# Altium schematic sheet schema3.SchDoc
size A3; DrawnBy: CdB; Engineer: CdB; Organization: Ultimaker B.V.; DocumentNumber: 3; Revision: 1548-I; SheetNumber: 3; SheetTotal: 6; PageSetup: Record=PageOptions|CenterHorizontal=True|CenterVertical=True|PrintScale=1.01|XCorrection=1.00|YCorrection=1.00|PrintKind=1|BorderSize=5000000|LeftOffset=0|BottomOffset=0|Orientation=2|PaperLength=1000|PaperWidth=1000|Scale=100|PaperSource=7|PrintQuality=600|MediaType=1|DitherType=10|PaperKind=A3 (297 x 420mm)|PrintScaleMode=1
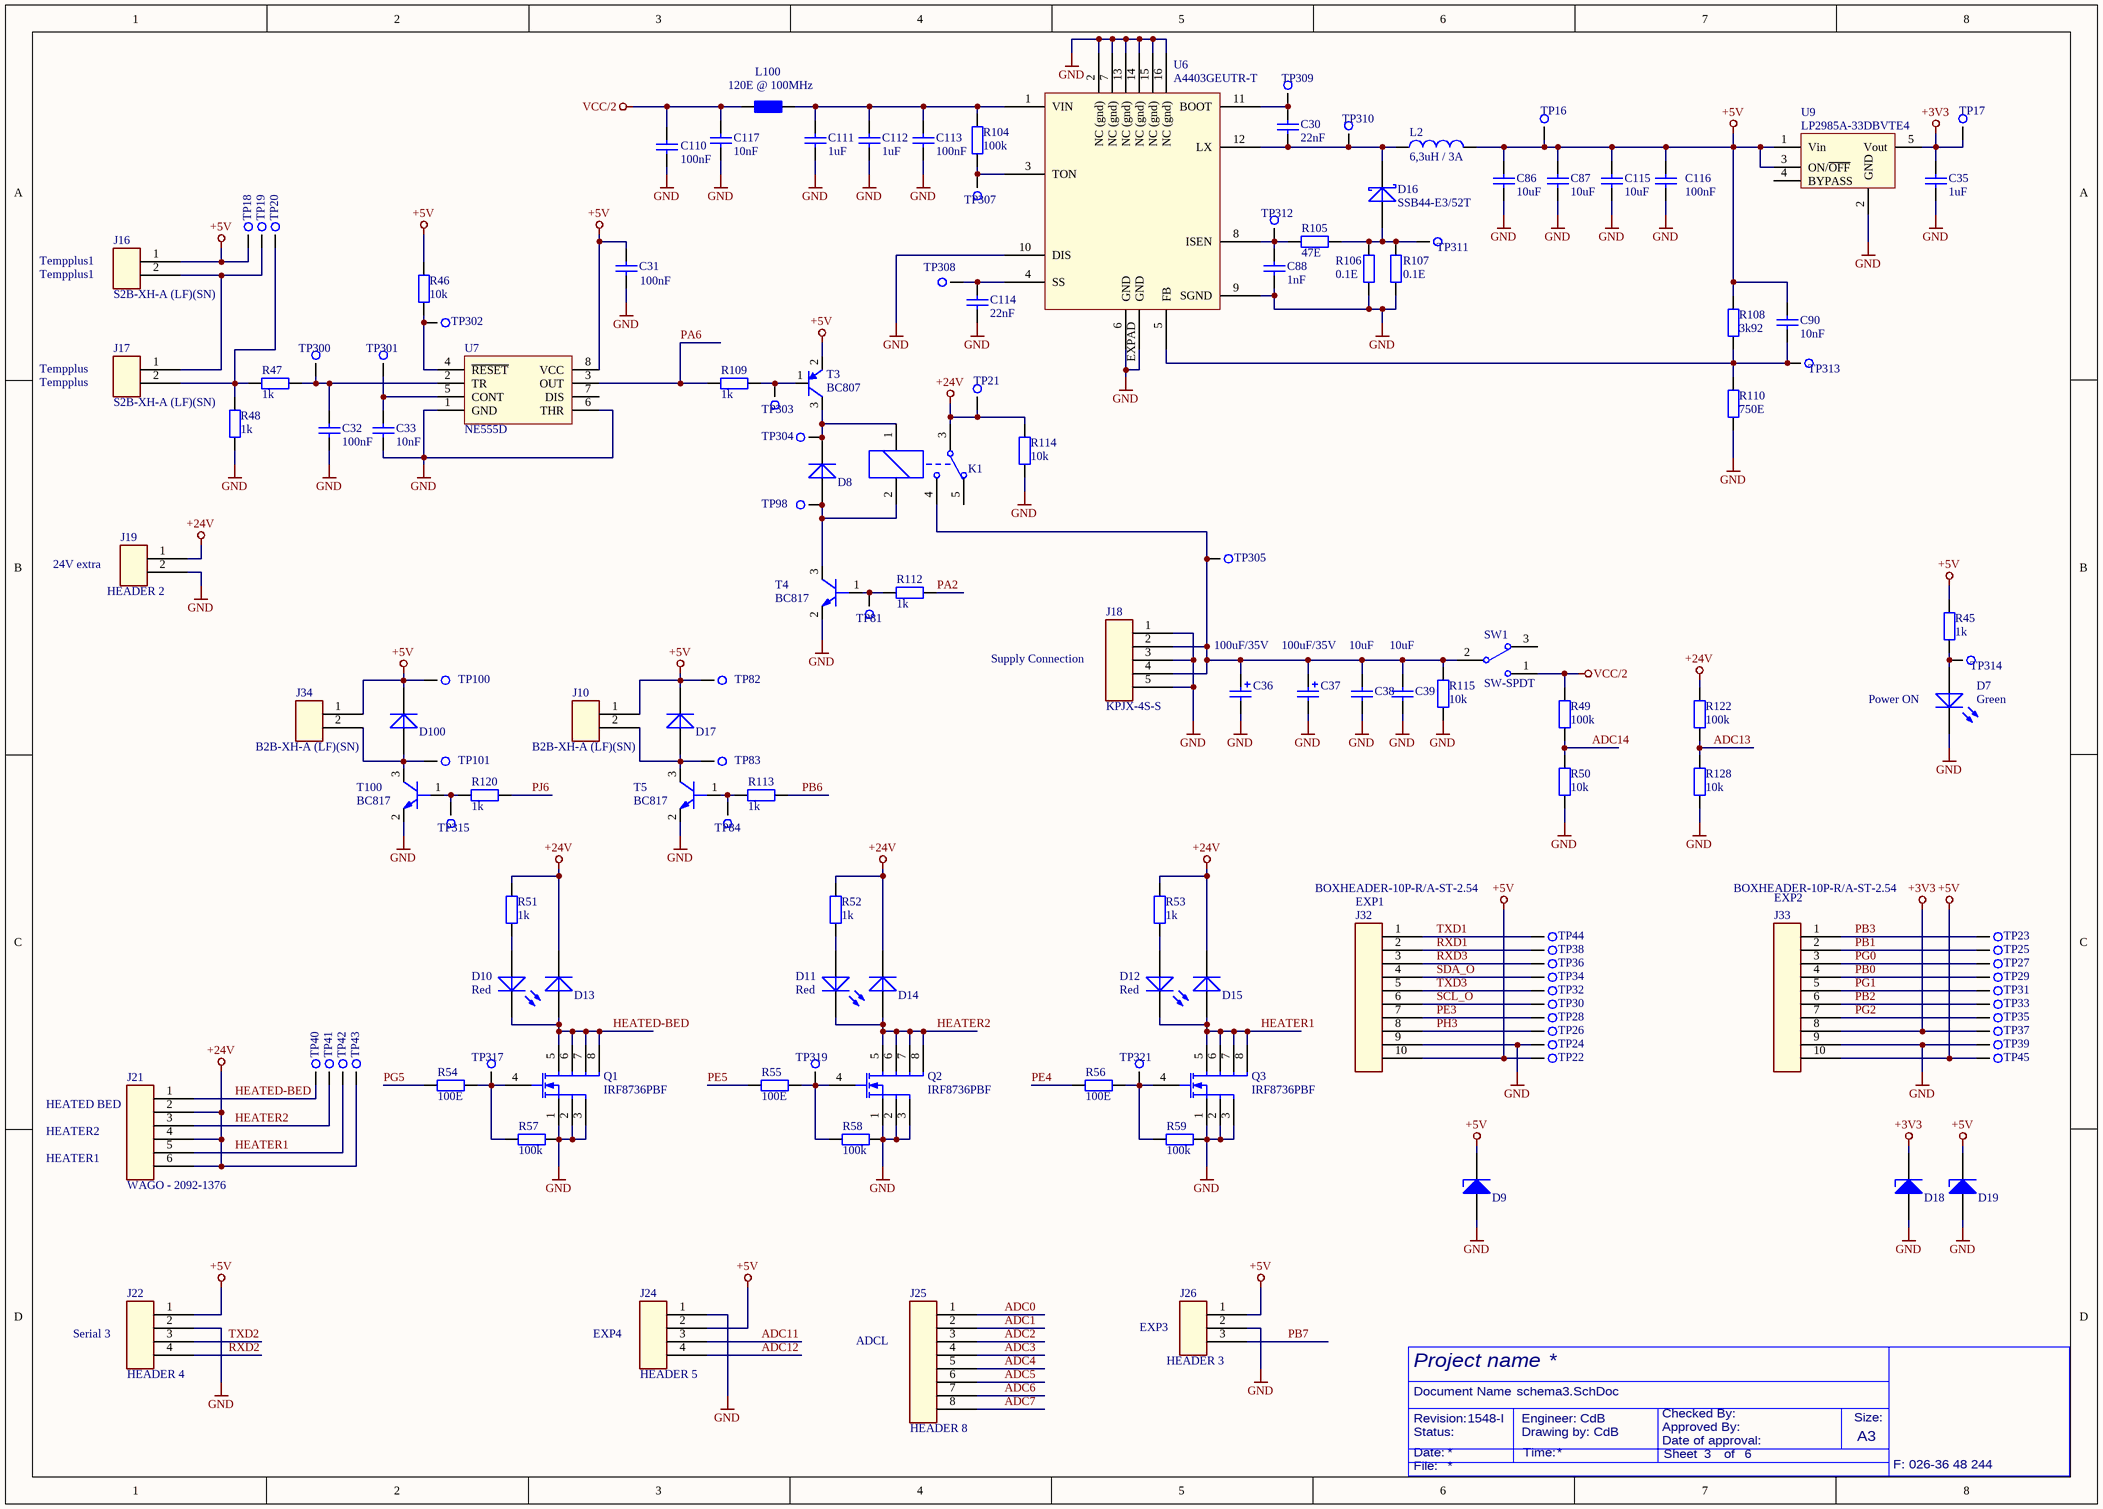
[diagram p0: schema3.SchDoc]

## Parts
C30  22nF  [C0603]
C31  100nF  [C0603]
C32  100nF  [C0603]
C33  10nF  [C0603]
C35  1uF  [C0603]
C36  100uF/35V  [ELCO Case D]
C37  100uF/35V  [ELCO Case D]
C38  10uF  [C1206]
C39  10uF  [C1206]
C86  10uF  [C0805]
C87  10uF  [C0805]
C88  1nF  [C0603]
C90  10nF  [C0603]
C110  100nF  [C0603]
C111  1uF  [C1206]
C112  1uF  [C1206]
C113  100nF  [C0603]
C114  22nF  [C0603]
C115  10uF  [C0805]
C116  100nF  [C0603]
C117  10nF  [C0603]
D7  Green  [LED0805-GREEN]
D8  S1G  [DO214AC (SMA)]  (value not drawn)
D9  ESD9X5.0ST5G  [SODFL100X40-2N]  (value not drawn)
D10  Red  [LED0805-RED]
D11  Red  [LED0805-RED]
D12  Red  [LED0805-RED]
D13  S1G  [DO214AC (SMA)]  (value not drawn)
D14  S1G  [DO214AC (SMA)]  (value not drawn)
D15  S1G  [DO214AC (SMA)]  (value not drawn)
D16  SSB44-E3/52T  [DO214AA (SMB)]
D17  S1G  [DO214AC (SMA)]  (value not drawn)
D18  ESD9X3.3ST5G  [SODFL100X40-2N]  (value not drawn)
D19  ESD9X5.0ST5G  [SODFL100X40-2N]  (value not drawn)
D100  S1G  [DO214AC (SMA)]  (value not drawn)
J10  B2B-XH-A (LF)(SN)  [B2B-XH-A (LF)(SN)]
J16  S2B-XH-A (LF)(SN)  [S2B-XH-A (LF)(SN)]
J17  S2B-XH-A (LF)(SN)  [S2B-XH-A (LF)(SN)]
J18  KPJX-4S-S  [KPJX-4S-S]
J19  HEADER 2  [HEADER-1x2P-ST-2.54]
J21  WAGO - 2092-1376  [WAGO 2092-1376]
J22  HEADER 4  [HEADER-1x4P-ST-2.54]
J24  HEADER 5  [HEADER-1x4P-ST-2.54]
J25  HEADER 8  [HEADER-1x8P-ST-2.54]
J26  HEADER 3  [HEADER-1x3P-ST-2.54]
J32  BOXHEADER-10P-R/A-ST-2.54  [BOXHEADER-10P-R/A-ST-2.54]
J33  BOXHEADER-10P-R/A-ST-2.54  [BOXHEADER-10P-R/A-ST-2.54]
J34  B2B-XH-A (LF)(SN)  [B2B-XH-A (LF)(SN)]
K1  Relay-SPDT  [HRS4-S]  (value not drawn)
L2  6,3uH / 3A  [NRS6045]
L100  120E @ 100MHz  [R0603]
Q1  IRF8736PBF  [SOIC127P600X175-8N (SO8)]
Q2  IRF8736PBF  [SOIC127P600X175-8N (SO8)]
Q3  IRF8736PBF  [SOIC127P600X175-8N (SO8)]
R45  1k  [R0603]
R46  10k  [R0603]
R47  1k  [R0603]
R48  1k  [R0603]
R49  100k  [R0603]
R50  10k  [R0603]
R51  1k  [R0603]
R52  1k  [R0603]
R53  1k  [R0603]
R54  100E  [R0603]
R55  100E  [R0603]
R56  100E  [R0603]
R57  100k  [R0603]
R58  100k  [R0603]
R59  100k  [R0603]
R104  100k  [R0603]
R105  47E  [R0603]
R106  0.1E  [R0805]
R107  0.1E  [R0805]
R108  3k92  [R0603]
R109  1k  [R0603]
R110  750E  [R0603]
R112  1k  [R0603]
R113  1k  [R0603]
R114  10k  [R1206]
R115  10k  [R1206]
R120  1k  [R0603]
R122  100k  [R0603]
R128  10k  [R0603]
SW1  SW-SPDT  [RS 734-6918]
T3  BC807  [SOT23]
T4  BC817  [SOT23]
T5  BC817  [SOT23]
T100  BC817  [SOT23]
TP16  Testpoint  [Testpoint]  (value not drawn)
TP17  Testpoint  [Testpoint]  (value not drawn)
TP18  Testpoint  [Testpoint]  (value not drawn)
TP19  Testpoint  [Testpoint]  (value not drawn)
TP20  Testpoint  [Testpoint]  (value not drawn)
TP21  Testpoint  [Testpoint]  (value not drawn)
TP22  Testpoint  [Testpoint]  (value not drawn)
TP23  Testpoint  [Testpoint]  (value not drawn)
TP24  Testpoint  [Testpoint]  (value not drawn)
TP25  Testpoint  [Testpoint]  (value not drawn)
TP26  Testpoint  [Testpoint]  (value not drawn)
TP27  Testpoint  [Testpoint]  (value not drawn)
TP28  Testpoint  [Testpoint]  (value not drawn)
TP29  Testpoint  [Testpoint]  (value not drawn)
TP30  Testpoint  [Testpoint]  (value not drawn)
TP31  Testpoint  [Testpoint]  (value not drawn)
TP32  Testpoint  [Testpoint]  (value not drawn)
TP33  Testpoint  [Testpoint]  (value not drawn)
TP34  Testpoint  [Testpoint]  (value not drawn)
TP35  Testpoint  [Testpoint]  (value not drawn)
TP36  Testpoint  [Testpoint]  (value not drawn)
TP37  Testpoint  [Testpoint]  (value not drawn)
TP38  Testpoint  [Testpoint]  (value not drawn)
TP39  Testpoint  [Testpoint]  (value not drawn)
TP40  Testpoint  [Testpoint]  (value not drawn)
TP41  Testpoint  [Testpoint]  (value not drawn)
TP42  Testpoint  [Testpoint]  (value not drawn)
TP43  Testpoint  [Testpoint]  (value not drawn)
TP44  Testpoint  [Testpoint]  (value not drawn)
TP45  Testpoint  [Testpoint]  (value not drawn)
TP81  Testpoint 1.6mm  [TESTPOINT]  (value not drawn)
TP82  Testpoint  [Testpoint]  (value not drawn)
TP83  Testpoint  [Testpoint]  (value not drawn)
TP84  Testpoint 1.6mm  [Testpoint 1.6mm]  (value not drawn)
TP98  Testpoint 1.6mm  [Testpoint 1.6mm]  (value not drawn)
TP100  Testpoint  [Testpoint]  (value not drawn)
TP101  Testpoint  [Testpoint]  (value not drawn)
TP300  Testpoint 1.6mm  [Testpoint 1.6mm]  (value not drawn)
TP301  Testpoint 1.6mm  [Testpoint 1.6mm]  (value not drawn)
TP302  Testpoint 1.6mm  [Testpoint 1.6mm]  (value not drawn)
TP303  Testpoint 1.6mm  [Testpoint 1.6mm]  (value not drawn)
TP304  Testpoint 1.6mm  [Testpoint 1.6mm]  (value not drawn)
TP305  Testpoint 1.6mm  [Testpoint 1.6mm]  (value not drawn)
TP307  Testpoint 1.6mm  [Testpoint 1.6mm]  (value not drawn)
TP308  Testpoint 1.6mm  [Testpoint 1.6mm]  (value not drawn)
TP309  Testpoint 1.6mm  [Testpoint 1.6mm]  (value not drawn)
TP310  Testpoint 1.6mm  [Testpoint 1.6mm]  (value not drawn)
TP311  Testpoint 1.6mm  [Testpoint 1.6mm]  (value not drawn)
TP312  Testpoint 1.6mm  [Testpoint 1.6mm]  (value not drawn)
TP313  Testpoint 1.6mm  [Testpoint 1.6mm]  (value not drawn)
TP314  Testpoint 1.6mm  [Testpoint 1.6mm]  (value not drawn)
TP315  Testpoint 1.6mm  [Testpoint 1.6mm]  (value not drawn)
TP317  Testpoint 1.6mm  [Testpoint 1.6mm]  (value not drawn)
TP319  Testpoint 1.6mm  [Testpoint 1.6mm]  (value not drawn)
TP321  Testpoint 1.6mm  [Testpoint 1.6mm]  (value not drawn)
U6  A4403GEUTR-T  [QFN65P400X400X80-16N-EX]
U7  NE555D  [SOIC127P600X175-8N (SO8)]
U9  LP2985A-33DBVTE4  [SOT95P280X145-5N (SOT23-5L)]

## Nets
+3V3: C35.2 D18.1(K) J33.8 TP17.1 TP37.1 U9.5(Vout)
+5V: C31.2 C86.2 C87.2 C90.2 C115.2 C116.2 D9.1(K) D17.2(K) D19.1(K) D100.2(K) J10.1 J16.1 J22.1 J24.2 J26.1 J32.10 J33.10 J34.1 L2.2 R45.2 R46.2 R108.2 T3.2(E) TP16.1 TP18.1 TP22.1 TP45.1 TP82.1 TP100.1 U7.8(VCC) U9.1(Vin) U9.3(ON/~{OFF})
+24V: D13.2(K) D14.2(K) D15.2(K) J19.1 J21.2 J21.4 J21.6 K1.3 R51.2 R52.2 R53.2 R114.2 R122.2 TP21.1 TP43.1
GND: C31.1 C32.1 C33.1 C35.1 C36.2 C37.2 C38.1 C39.1 C86.1 C87.1 C88.1 C110.1 C111.1 C112.1 C113.1 C114.1 C115.1 C116.1 C117.1 D7.2(K) D9.2(A) D18.2(A) D19.2(A) J18.1 J18.3 J18.5 J19.2 J22.2 J24.1 J26.2 J32.9 J33.9 Q1.1(S) Q1.2(S) Q1.3(S) Q2.1(S) Q2.2(S) Q2.3(S) Q3.1(S) Q3.2(S) Q3.3(S) R48.1 R50.1 R57.2 R58.2 R59.2 R106.1 R107.1 R110.1 R114.1 R115.1 R128.1 T4.2(EMITTER) T5.2(EMITTER) T100.2(EMITTER) TP24.1 TP39.1 U6.2(NC_(gnd)) U6.6(GND) U6.7(NC_(gnd)) U6.9(SGND) U6.10(DIS) U6.13(NC_(gnd)) U6.14(NC_(gnd)) U6.15(NC_(gnd)) U6.16(NC_(gnd)) U6.EXPAD(GND) U7.1(GND) U7.6(THR) U9.2(GND)
VCC/2: C110.2 C117.2 L100.1 R49.2 SW1.1
ADC0: J25.1
ADC1: J25.2
ADC2: J25.3
ADC3: J25.4
ADC4: J25.5
ADC5: J25.6
ADC6: J25.7
ADC7: J25.8
ADC11: J24.3
ADC12: J24.4
ADC13: R122.1 R128.2
ADC14: R49.1 R50.2
HEATED-BED: D10.2(K) D13.1(A) J21.1 Q1.5(D) Q1.6(D) Q1.7(D) Q1.8(D) TP40.1
HEATER1: D12.2(K) D15.1(A) J21.5 Q3.5(D) Q3.6(D) Q3.7(D) Q3.8(D) TP42.1
HEATER2: D11.2(K) D14.1(A) J21.3 Q2.5(D) Q2.6(D) Q2.7(D) Q2.8(D) TP41.1
PA2: R112.1
PA6: R109.1 U7.3(OUT)
PB0: J33.4 TP29.1
PB1: J33.2 TP25.1
PB2: J33.6 TP33.1
PB3: J33.1 TP23.1
PB6: R113.1
PB7: J26.3
PE3: J32.7 TP28.1
PE4: R56.1
PE5: R55.1
PG0: J33.3 TP27.1
PG1: J33.5 TP31.1
PG2: J33.7 TP35.1
PG5: R54.1
PH3: J32.8 TP26.1
PJ6: R120.1
RXD1: J32.2 TP38.1
RXD2: J22.4
RXD3: J32.3 TP36.1
SCL_O: J32.6 TP30.1
SDA_O: J32.4 TP34.1
TXD1: J32.1 TP44.1
TXD2: J22.3
TXD3: J32.5 TP32.1
NetC30_1: C30.1 D16.2(K) L2.1 TP310.1 U6.12(LX)
NetC30_2: C30.2 TP309.1 U6.11(BOOT)
NetC32_2: C32.2 R47.2 TP300.1 U7.2(TR)
NetC33_2: C33.2 TP301.1 U7.5(CONT)
NetC36_1: C36.1 C37.1 C38.2 C39.2 J18.2 J18.4 K1.4 R115.2 SW1.2 TP305.1
NetC88_2: C88.2 R105.1 TP312.1 U6.8(ISEN)
NetC90_1: C90.1 R108.1 R110.2 TP313.1 U6.5(FB)
NetC111_2: C111.2 C112.2 C113.2 L100.2 R104.2 U6.1(VIN)
NetC114_2: C114.2 TP308.1 U6.4(SS)
NetD7_1: D7.1(A) R45.1 TP314.1
NetD8_1: D8.1(A) K1.2 T4.3(COLLECTOR) TP98.1
NetD8_2: D8.2(K) K1.1 T3.3(C) TP304.1
NetD10_1: D10.1(A) R51.1
NetD11_1: D11.1(A) R52.1
NetD12_1: D12.1(A) R53.1
NetD16_1: D16.1(A) R105.2 R106.2 R107.2 TP311.1
NetD17_1: D17.1(A) J10.2 T5.3(COLLECTOR) TP83.1
NetD100_1: D100.1(A) J34.2 T100.3(COLLECTOR) TP101.1
NetJ16_2: J16.2 J17.1 TP19.1
NetJ17_2: J17.2 R47.1 R48.2 TP20.1
NetQ1_4: Q1.4(G) R54.2 R57.1 TP317.1
NetQ2_4: Q2.4(G) R55.2 R58.1 TP319.1
NetQ3_4: Q3.4(G) R56.2 R59.1 TP321.1
NetR46_1: R46.1 TP302.1 U7.4(~{RESET})
NetR104_1: R104.1 TP307.1 U6.3(TON)
NetR109_2: R109.2 T3.1(B) TP303.1
NetR112_2: R112.2 T4.1(BASE) TP81.1
NetR113_2: R113.2 T5.1(BASE) TP84.1
NetR120_2: R120.2 T100.1(BASE) TP315.1

Not connected (* = marked no-connect by the designer): K1 5; SW1 3; U7 7(DIS); U9 4(BYPASS)

## Notes on the sheet
- (near J16) Tempplus1
- (near J17) Tempplus
- (near J19) 24V extra
- (near J18) Supply Connection
- (near D7) Power ON
- (near J32) EXP1
- (near J33) EXP2
- (near J21) HEATED BED
- HEATER1
- HEATER2
- (near J22) Serial 3
- (near J24) EXP4
- ADCL
- (near J26) EXP3
- Project name
- Document Name
- Revision:
- Date:
- Status:
- Engineer:
- Drawing by:
- Time:
- Approved By:
- Checked By:
- Date of approval:
- Sheet
- of
- Size:
- A3
- File:
- F: 026-36 48 244

## Library data of the parts
C30 C114 = Library_CAP-0011: RO X7R 22nF 10% 0603 50V CC0603KRX7R9BB223; Faber ItemCode: 36795200; ID: Library_CAP-0011; Value: 22nF
C31 C32 C110 C113 C116 = Library_CAP-0002: RO X7R 100nF 10% 50V 0603; Faber ItemCode: 45068500; ID: Library_CAP-0002; Value: 100nF
C33 C90 C117 = Library_CAP-0007: RO X7R 10nF 10% 50V 0603; Faber ItemCode: 36270400; ID: Library_CAP-0007; Value: 10nF
C35 = Library_CAP-0006: RO X5R 1uF 10% 10V 0603; Faber ItemCode: 36310600; ID: Library_CAP-0006; Value: 1uF
C36 C37 = Library_CAP-0004: RO ELCO 100uF 20% 35V CASE-D EEEFP PAN; Faber ItemCode: 36865800; ID: Library_CAP-0004; Value: 100uF/35V
C38 C39 = Library_CAP-0005: RO X5R 10UF 10% 35V 1206; Faber ItemCode: 35436800; ID: Library_CAP-0005; Value: 10uF
C86 C87 C115 = Library_CAP-0012: 6R3R15X106KV4E - MLCC, 0805, X5R, 6.3V, 10UF; Mfg: JOHANSON DIELECTRICS; ID: Library_CAP-0012; Mfg code: 6R3R15X106KV4E; Value: 10uF
C88 = Library_CAP-0013: RO C0G 1nF 5% 50V 0603; Faber ItemCode: 35288300; ID: Library_CAP-0013; Value: 1nF
C111 C112 = Capacitor_1_1: X7R 1uF 10% 50V 1206 GRM31; ID: Library_CAP-0005; Faber ItemCode: 35387100; Value: 1uF
D7 = Library_LED-0002: RO LED GROEN HSMG-C170 0805 AVAGO; Faber ItemCode: 35162200; Mfg: AVAGO; Mfg code: HSMG-C170; ID: Library_LED-0002; Value: Green
D8 D13-D15 D17 D100 = Library_DIO-0001: RO DIODE S1G DO-214AC; Faber ItemCode: 32284000; Info: Fast Rectifiers 1A 400V; ID: Library_DIO-0001; Value: S1G
D9 D19 = ESD9X5.0ST5G: TVS DIODE 5VWM 12.3VC SOD923; Mfg: ON Semiconductor; Type: Zener; Unidirectional Channels: 1; Voltage - Reverse Standoff (Typ): 5V (Max); Voltage - Breakdown (Min): 6.2V; Voltage - Clamping (Max) @ Ipp: 12.3V; Current - Peak Pulse (10/1000µs): 8.7A (8/20µs); Power - Peak Pulse: 107W; Power Line Protection: No; Capacitance @ Frequency: 65pF @ 1MHz; Supplier 1: Digi-Key; Supplier Part Number 1: ESD9X5.0ST5GOSTR-ND; Mfg code: ESD9X5.0ST5G; RoHS: RoHS Compliant; Category: Circuit Protection; Stock: 40000; Pricing: 8000=0.02337, 16000=0.02032, 24000=0.01829, 56000=0.01626, 200000=0.01351 (EUR); Packaging: Tape & Reel (TR); Bidirectional Channels: -; Applications: General Purpose; Operating Temperature: -55°C ~ 150°C (TJ); Mounting Type: Surface Mount; Package / Case: SOD-923; Supplier Device Package: SOD-923; ComponentLink1URL: http://www.onsemi.com/pub_link/Collateral/ESD9X3.3ST5G-D.PDF; ComponentLink1Description: http://www.onsemi.com/pub_link/Collateral/ESD9X3.3ST5G-D.PDF
D10-D12 = Library_LED-0001: RO LED ROOD HSMH-C170 0805 AVAGO; Faber ItemCode: 35162100; Mfg: AVAGO; Mfg code: HSMH-C170; ID: Library_LED-0001; Value: Red
D16 = Library_DIO-0003: RO DIODE SSB44-E3/52T SMB VISHAY; Info: High-Current Density Surface Mount Schottky Rectifier; Faber ItemCode: 36925500; ID: Library_DIO-0003; Mfg: VISHAY; Mfg code: SSB44-E3/52T; Value: SSB44-E3/52T
D18 = ESD9X3.3ST5G: TVS DIODE 3.3VWM 10.4VC SOD923; Mfg: ON Semiconductor; Type: Zener; Unidirectional Channels: 1; Voltage - Reverse Standoff (Typ): 3.3V (Max); Voltage - Breakdown (Min): 5V; Voltage - Clamping (Max) @ Ipp: 10.4V; Current - Peak Pulse (10/1000µs): 9.8A (8/20µs); Power - Peak Pulse: 102W; Power Line Protection: No; Capacitance @ Frequency: 80pF @ 1MHz; Supplier 1: Digi-Key; Supplier Part Number 1: ESD9X3.3ST5GOSTR-ND; Mfg code: ESD9X3.3ST5G; RoHS: RoHS Compliant; Category: Circuit Protection; Stock: 136000; Pricing: 8000=0.03287, 16000=0.02794, 24000=0.02629, 56000=0.02465, 200000=0.02136 (EUR); Packaging: Tape & Reel (TR); Bidirectional Channels: -; Applications: Automotive; Operating Temperature: -55°C ~ 150°C (TJ); Mounting Type: Surface Mount; Package / Case: SOD-923; Supplier Device Package: SOD-923; ComponentLink1URL: http://www.onsemi.com/pub_link/Collateral/ESD9X3.3ST5G-D.PDF; ComponentLink1Description: http://www.onsemi.com/pub_link/Collateral/ESD9X3.3ST5G-D.PDF
J10 J34 = HEADER 2_3: CONN PR 2p B2B-XH-A JST; ID: Library_CON-0004; Mfg: JST (JAPAN SOLDERLESS TERMINALS); Faber ItemCode: 36863500; Mfg code: B2B-XH-A (LF)(SN); Value: B2B-XH-A (LF)(SN)
J16 J17 = Library_CON-0004: RO CONN PR 2p HKS S2B-XH-A (LF)(SN) JST; Mfg: JST (JAPAN SOLDERLESS TERMINALS); Faber ItemCode: 36926700; Mfg code: S2B-XH-A (LF)(SN); ID: Library_CON-0004; Value: S2B-XH-A (LF)(SN)
J18 = Library_CON-0009: RO CONN PR KPJX-4S-S KYCON; Info: Shielded version; Faber ItemCode: 36925000; Mfg: KYCON; Mfg code: KPJX-4S-S; ID: Library_CON-0009; Value: KPJX-4S-S
J19 = Library_CON-0013: HEADER-1x2P-ST-2.54; ID: Library_CON-0013; Value: HEADER 2
J21 = Library_CON-0008: WAGO - 2092-1376 - TERMINAL BLOCK, PCB, R/A, 6WAY, 24-12AWG; Farnell code: 2352417; Mfg: Wago; Mfg code: 2092-1376
J22 J24 = Library_CON-0014: HEADER-1x4P-ST-2.54; ID: Library_CON-0014
  J22: Value: HEADER 4
  J24: Value: HEADER 5
J25 = Library_CON-0016: HEADER-1x8P-ST-2.54; ID: Library_CON-0016; Value: HEADER 8
J26 = Library_CON-0017: HEADER-1x3P-ST-2.54; ID: Library_CON-0017; Value: HEADER 3
J32 J33 = Library_CON-0019: RO CONN PR HDR BOX 10p HKS 61201021721 WUERTH; Faber ItemCode: 36925800; ID: Library_CON-0019; Value: BOXHEADER-10P-R/A-ST-2.54
K1 = Library_REL-0001: RO REL 5V HRS4-S DC5V MULTICOMP; Faber ItemCode: 36924900; ID: Library_REL-0001; Mfg: MULTICOMP; Mfg code: HRS4-S DC5V; Value: HRS4-S
L2 = Library_COIL-0002: RO SPOEL 6,3uH 20% NRS6045T 6R3MMGK TAIYO YUDEN; Faber ItemCode: 36925300; ID: Library_COIL-0002; Mfg code: NRS6045T 6R3MMGK; Value: 6,3uH / 3A; Mfg: TAIYO YUDEN
L100 = Ferriet Bead 120E: FERRIET BLM18PG121SN1D 0603 MURATA; Info: Resistor; ID: -; Faber ItemCode: -; Value: 120E @ 100MHz; Mfg: Murata; Mfg code: BLM18PG121SN1D
Q1-Q3 = LIBRARY_FET-0002: IRF8736PBF - MOSFET, N SO-8; Mfg: INTERNATIONAL RECTIFIER; Info: HEXFET Power MOSFET; Faber ItemCode: 36926000; Mfg code: IRF8736PBF; ID: LIBRARY_FET-0002; Value: IRF8736PBF
R45 R47 R48 R51-R53 R109 R112 R113 R120 = Library_RES-0004: RO RES 1k0 1% 0,1W  0603; Faber ItemCode: 34637900; ID: Library_RES-0004; Info: Resistor; Value: 1k
R46 R50 R128 = Library_RES-0001: RO RES 10k0 1% 0,063W  0603; Faber ItemCode: 36084500; ID: Library_RES-0001; Info: Resistor; Value: 10k
R49 R57-R59 R104 R122 = Library_RES-0005: RO RES 100k0 1% 0,063W  0603; Faber ItemCode: 36257800; ID: Library_RES-0005; Info: Resistor; Value: 100k
R54-R56 = Library_RES-0006: RO RES 100E 1% 0,063W  0603; Faber ItemCode: 32338800; ID: Library_RES-0006; Info: Resistor; Value: 100E
R105 = Library_RES-0017: RO RES 47E 1% 0,063W 0603; Faber ItemCode: 35030300; ID: Library_RES-0017; Info: Resistor; Value: 47E
R106 R107 = Library_RES-0016: RES 0E10 1% 0,125W 0805; Faber ItemCode: 35343500; ID: Library_RES-0016; Mfg: -; Mfg code: -; Info: Resistor; Value: 0.1E
R108 = Library_RES-0014: RO RES 3k92 1% 0.063W 0603; Faber ItemCode: 36767900; ID: Library_RES-0014; Info: Resistor; Value: 3k92
R110 = Library_RES-0015: RO RES 750E 1% 0,063W 0603; Faber ItemCode: 35154200; ID: Library_RES-0015; Info: Resistor; Value: 750E
R114 R115 = Library_RES-0001: RO RES 10k0 1% 0,25W 1206; Mfg: Multicomp; Mfg code: MCWR12X1002FTL; Value: 10k; Farnell code: 2447455RL
SW1 = Library_SWI-0001: Rocker switch,SPDT,on-none-on,RA,snap-in; Mfg: Dailywell Electronics; Mfg code: 4MS1R2022M6NQNS
T3 = Library_TRA-0002: RO TRANS BC807-40  SOT-23; Faber ItemCode: 30827800; Info: 45 V, 500 mA PNP general-purpose transistors; ID: Library_TRA-0002; Value: BC807
T4 T5 T100 = Library_TRA-0001: RO TRANS BC817-25  SOT-23; Faber ItemCode: 30828000; Info: 45 V, 500 mA NPN general-purpose transistors; ID: Library_TRA-0001; Value: BC817
TP16-TP45 TP82 TP83 TP100 TP101 = Library_MISC-0001: Info: Testpoint, 2mm, round; ID: Library_MISC-0001; Faber ItemCode: -; Mfg: -; Mfg code: -; Value: Testpoint
TP81 TP84 TP98 TP300-TP305 TP307-TP315 TP317 TP319 TP321 = Testpoint 1.6mm: ID: Library_MISC-0001; Faber ItemCode: -; Mfg: -; Mfg code: -; Info: Testpoint 1.6mm; Value: Testpoint 1.6mm
U6 = Library_ICS-0010: RO IC A4403GEUTR-T QFN-16 ALLEGRO; Info: Valley Current Mode Control Buck Converter; Faber ItemCode: 36924500; ID: Library_ICS-0010; Mfg: Allegro; Mfg code: A4403GEUTR-T; Value: A4403GEUTR-T
U7 = Library_ICS-0009: RO IC NE555D SO-08 TI; Faber ItemCode: 35318300; Mfg: Texas Instruments; Mfg code: SE555DRG4; Info: PRECISION TIMER; ID: Library_ICS-0009; Value: NE555D
U9 = Library_ICS-0008: RO STABI LP2985A-33DBVTE4 SOT-23-5 TI; Mfg: Texas Instruments; Info: 150-mA LOW-NOISE LOW-DROPOUT REGULATOR WITH SHUTDOWN; Faber ItemCode: 36925100; Mfg code: LP2985A-33DBVTE4; ID: Library_ICS-0008; Value: LP2985A-33DBVTE4